# EasyEDA schematic SCH_AD741-discrete_2022-10-03.json

## Sheets
1 P1: TITLE: Sheet_1; REV: 1.0; Date: 2022-10-02; Sheet: 1/1; Drawn By: Denjhang; Company: Your Company
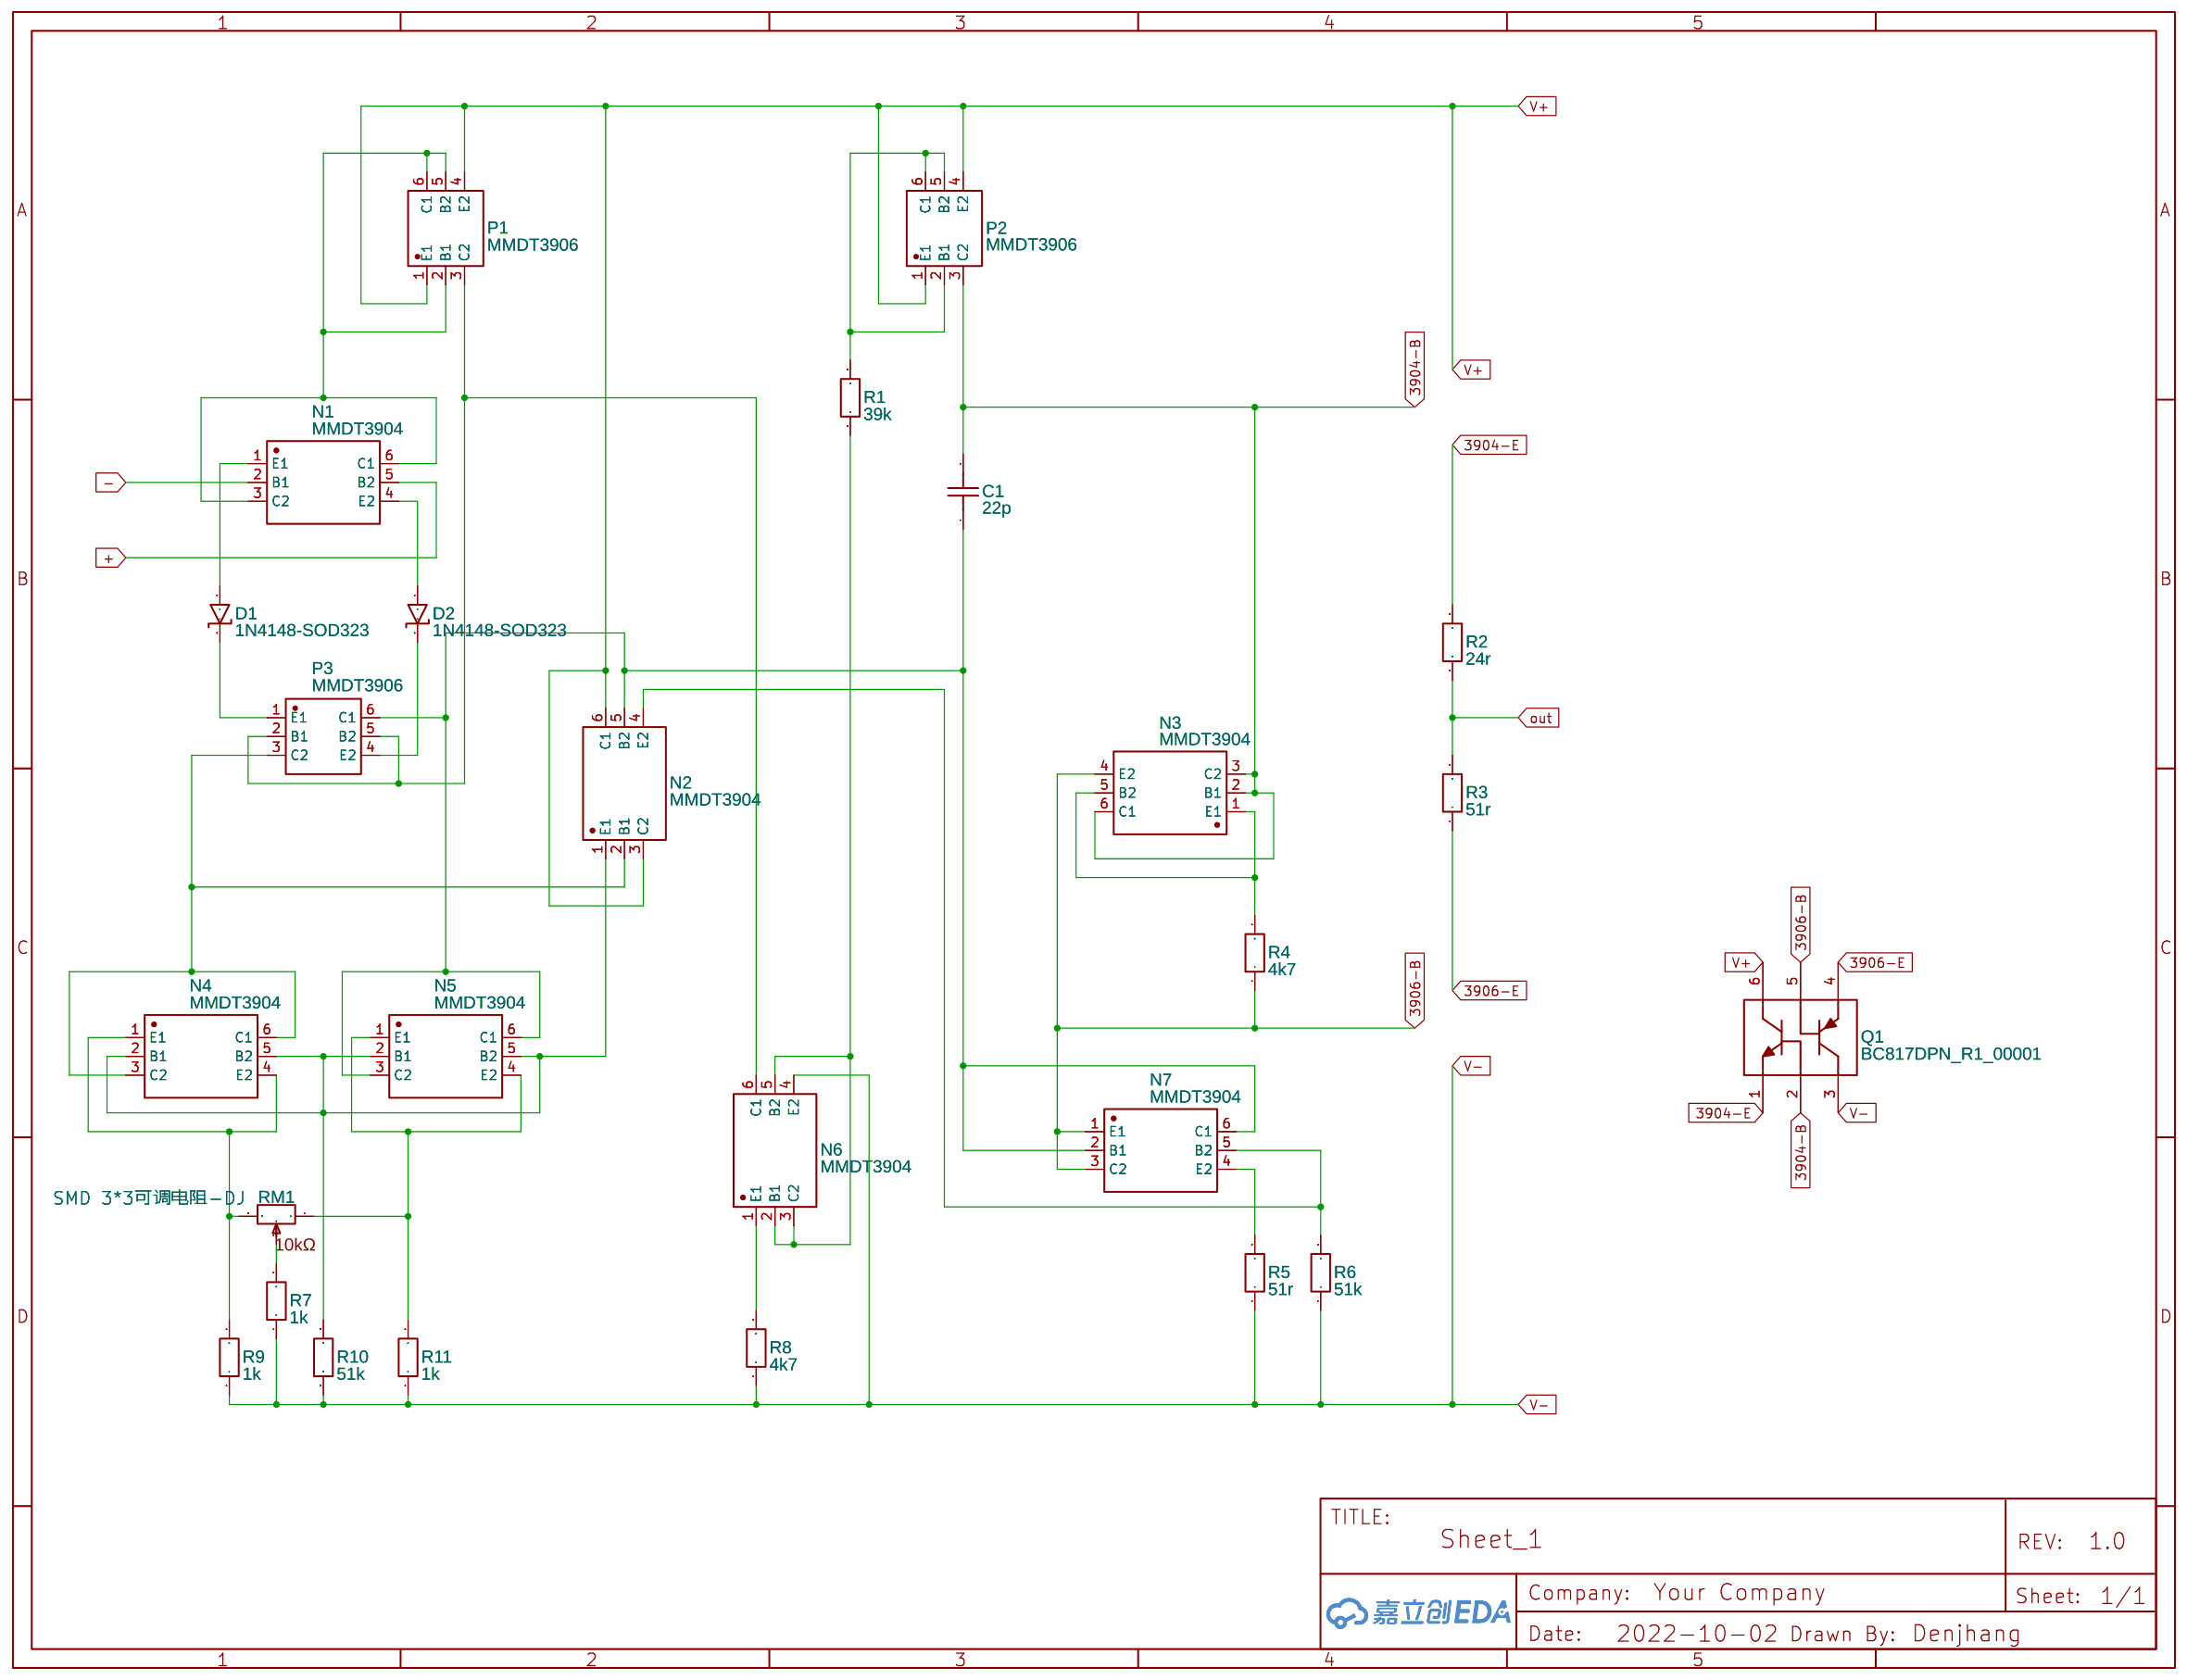
[diagram p0: P1]
2 CONN
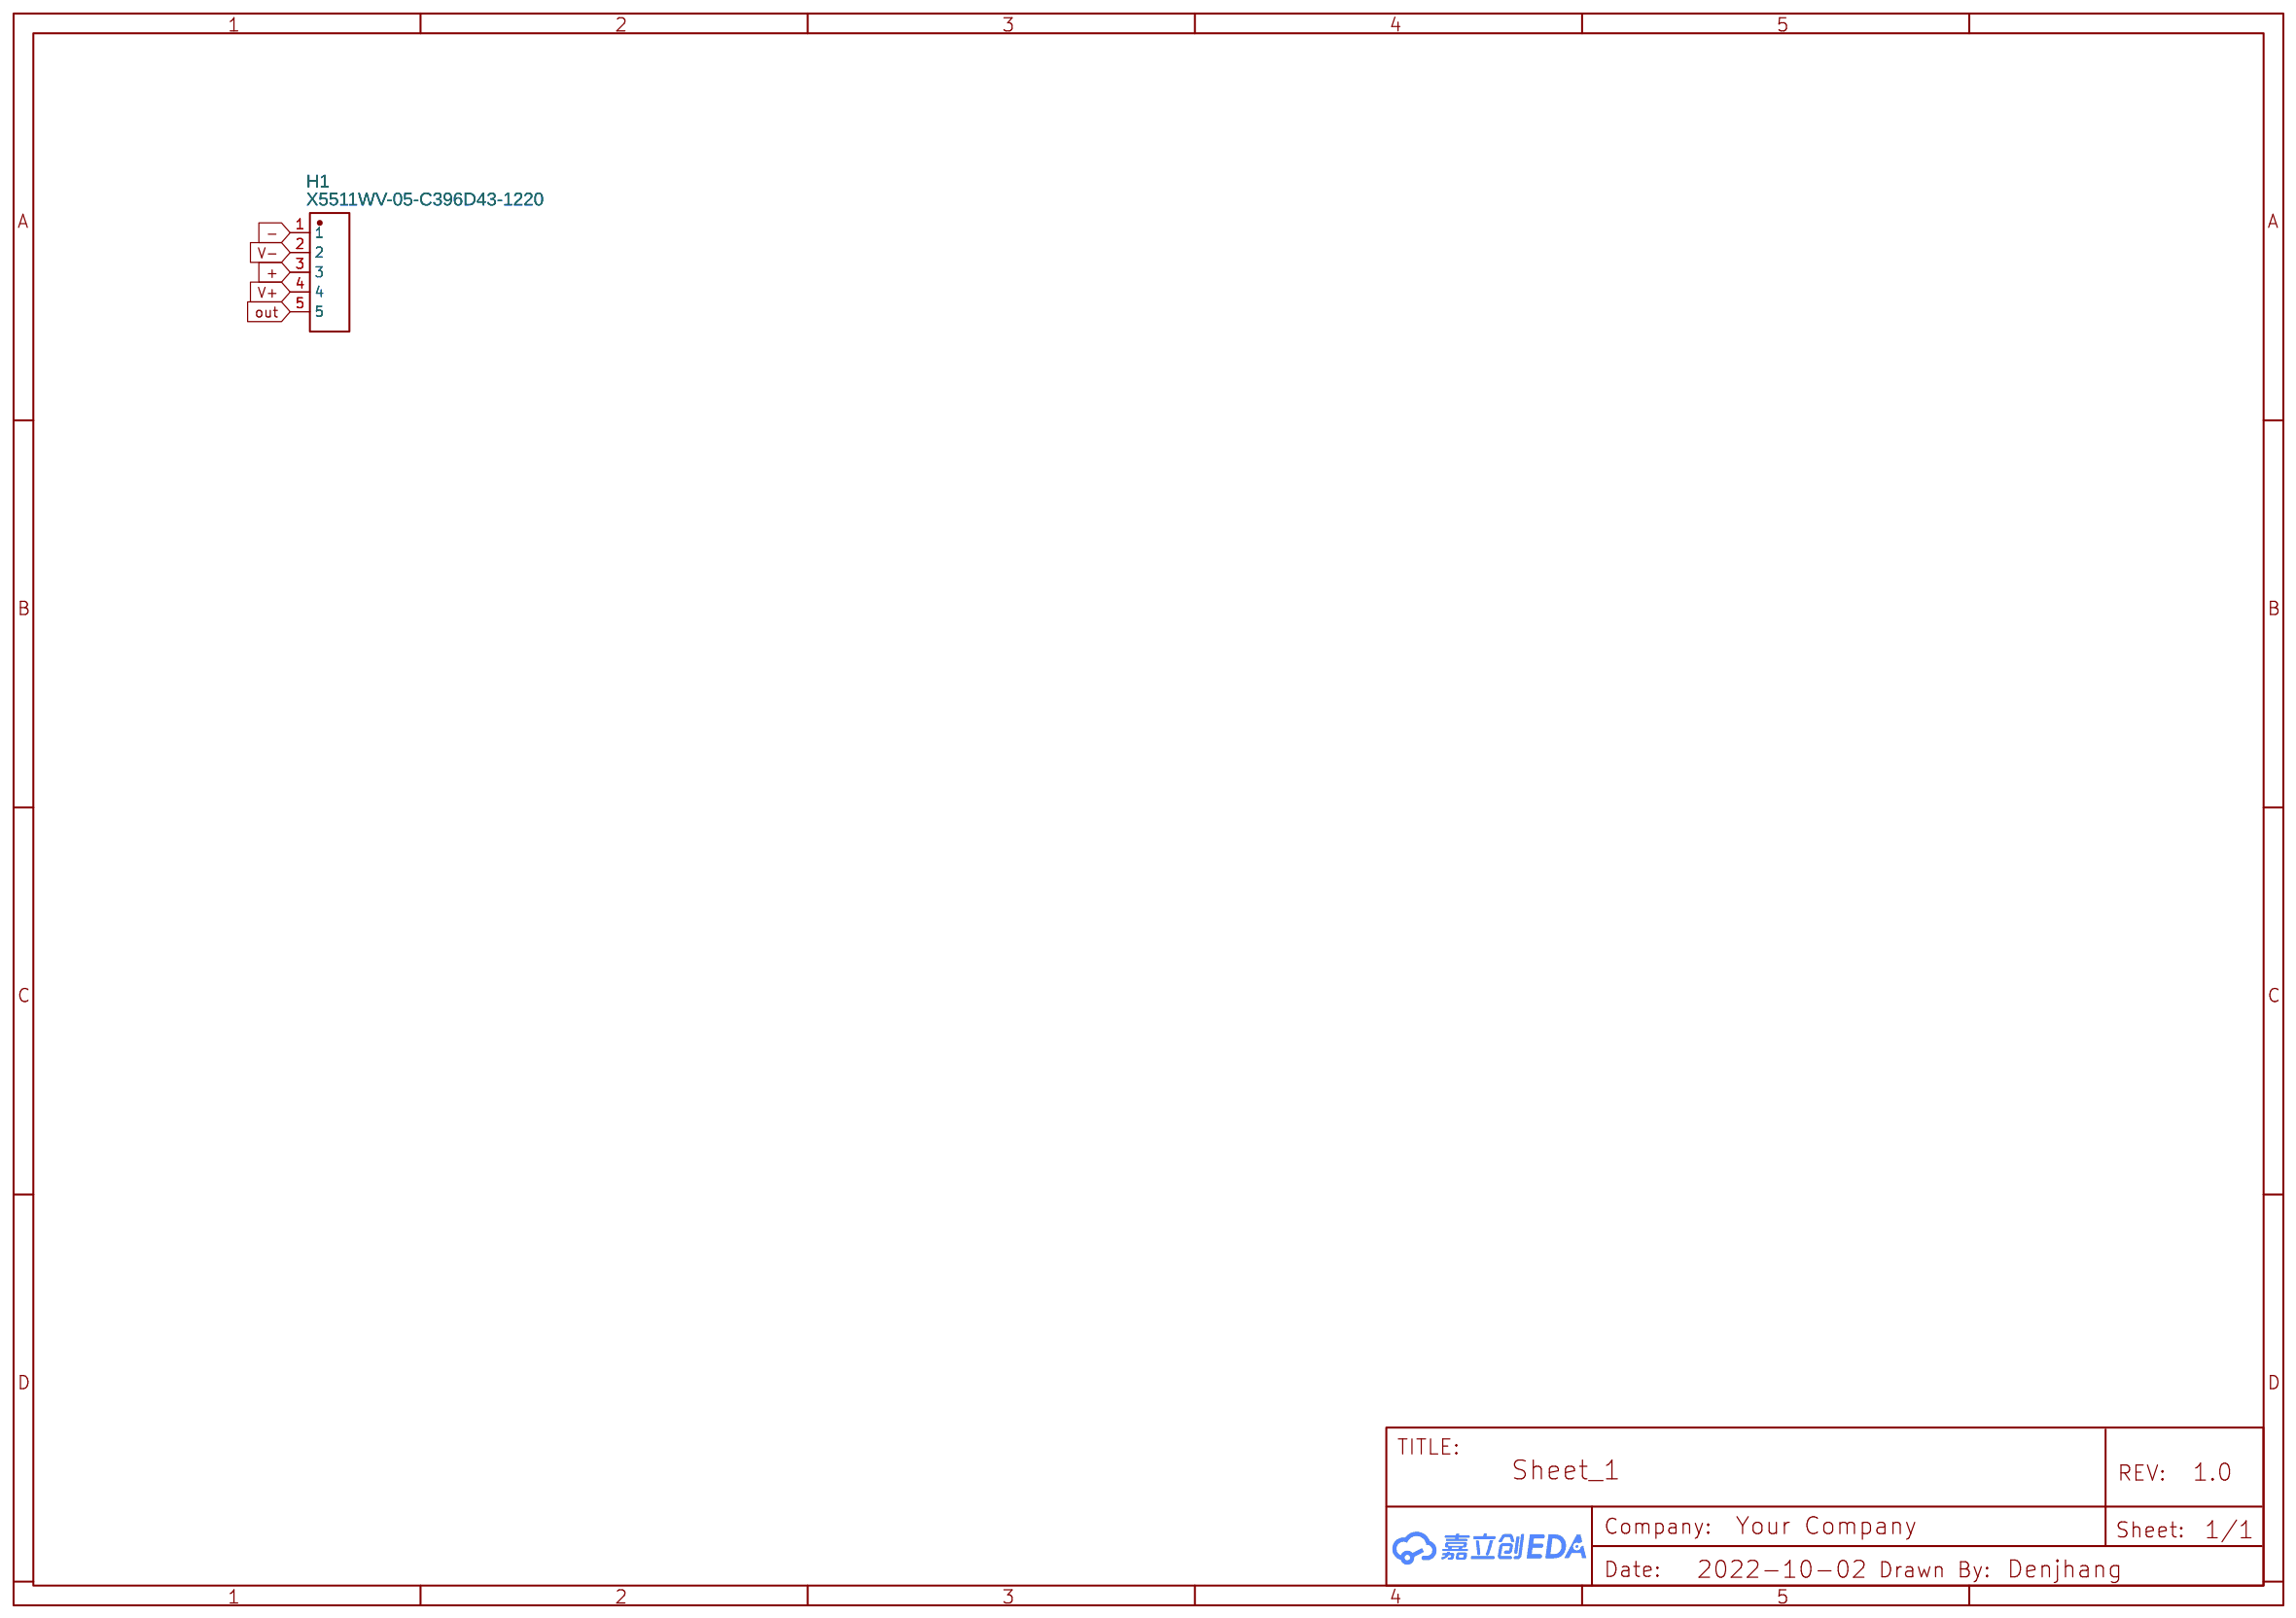
[diagram p1: CONN]

## Parts
sheet CONN
H1  X5511WV-05-C396D43-1220  [HDR-TH_5P-P2.54-V-M]
sheet P1
C1  22p  [C0603]
D1  1N4148-SOD323  [SOD-323_L1.7-W1.3-LS2.5-FD]
D2  1N4148-SOD323  [SOD-323_L1.7-W1.3-LS2.5-FD]
N1  MMDT3904  [SOT-363_L2.0-W1.3-P0.65-LS2.1-BR]
N2  MMDT3904  [SOT-363_L2.0-W1.3-P0.65-LS2.1-BR]
N3  MMDT3904  [SOT-363_L2.0-W1.3-P0.65-LS2.1-BR]
N4  MMDT3904  [SOT-363_L2.0-W1.3-P0.65-LS2.1-BR]
N5  MMDT3904  [SOT-363_L2.0-W1.3-P0.65-LS2.1-BR]
N6  MMDT3904  [SOT-363_L2.0-W1.3-P0.65-LS2.1-BR]
N7  MMDT3904  [SOT-363_L2.0-W1.3-P0.65-LS2.1-BR]
P1  MMDT3906  [SOT-363_L2.0-W1.3-P0.65-LS2.1-BL]
P2  MMDT3906  [SOT-363_L2.0-W1.3-P0.65-LS2.1-BL]
P3  MMDT3906  [SOT-363_L2.0-W1.3-P0.65-LS2.1-BL]
Q1  BC817DPN_R1_00001  [SOT-457_L2.9-W1.5-P0.95-LS2.8-BL]
R1  39k  [R0603]
R2  24r  [R0603]
R3  51r  [R0603]
R4  4k7  [R0603]
R5  51r  [R0603]
R6  51k  [R0603]
R7  1k  [R0603]
R8  4k7  [R0603]
R9  1k  [R0603]
R10  51k  [R0603]
R11  1k  [R0603]
RM1  SMD 3*3可调电阻-DJ  [3*3可调电阻]

## Library data of the parts
H1 = X5511WV-05-C396D43-1220: Supplier: LCSC; Supplier Part: C2883392; Manufacturer: XKB Connectivity(中国星坤); link: https://atta.szlcsc.com/upload/public/pdf/source/20211009/7D13F627EAEF227E7F3D2A55C463773D.pdf; Contributor: LCSC
C1 = C_0603_US: Contributor: LCEDA_Lib
D1 D2 = 1N4148-SOD323: Supplier: LCSC; Supplier Part: C9900014362; Manufacturer: null; JLCPCB Part Class: Extended Part; Contributor: Denjhang
N1-N7 = MMDT3904: Supplier: LCSC; Supplier Part: C21664; Manufacturer: Changjiang Electronics Tech (CJ); Contributor: LCSC; JLCPCB Part Class: Extended Part
P1-P3 = MMDT3906: Supplier: LCSC; Supplier Part: C20534; Manufacturer: Changjiang Electronics Tech (CJ); Contributor: LCSC; JLCPCB Part Class: Extended Part
Q1 = BC817DPN_R1_00001: Supplier: LCSC; Supplier Part: C696397; Manufacturer: PANJIT(强茂); Contributor: LCSC; JLCPCB Part Class: Extended Part
R1-R11 = R_0603_EU: Contributor: LCEDA_Lib
RM1 = SMD 3*3可调电阻-DJ: Contributor: Denjhang

## Nets
3904-B: C1.2 N3.2(B1) N3.3(C2) N3.6(C1) P2.3(C2) Q1.2(B1)
3904-E: Q1.1(E1) R2.2
3906-B: N3.4(E2) N7.1(E1) N7.3(C2) Q1.5(B2) R4.1
3906-E: Q1.4(E2) R3.1
+: H1.3 N1.5(B2)
-: H1.1 N1.2(B1)
out: H1.5 R2.1 R3.2
V+: H1.4 N2.3(C2) N2.6(C1) P1.1(E1) P1.4(E2) P2.1(E1) P2.4(E2) Q1.6(C1)
V-: H1.2 N6.4(E2) Q1.3(C2) R5.1 R6.1 R7.1 R8.1 R9.1 R10.1 R11.1
Net-(C1-1): C1.1 N2.5(B2) N5.3(C2) N5.6(C1) N7.2(B1) N7.6(C1) P3.6(C1)
Net-(D1-1): D1.1(A) N1.1(E1)
Net-(D1-2): D1.2(K) P3.1(E1)
Net-(D2-1): D2.1(A) N1.4(E2)
Net-(D2-2): D2.2(K) P3.4(E2)
Net-(N1-3): N1.3(C2) N1.6(C1) P1.2(B1) P1.5(B2) P1.6(C1)
Net-(N2-1): N2.1(E1) N4.2(B1) N4.5(B2) N5.2(B1) N5.5(B2) R10.2
Net-(N2-2): N2.2(B1) N4.3(C2) N4.6(C1) P3.3(C2)
Net-(N2-4): N2.4(E2) N7.5(B2) R6.2
Net-(N3-1): N3.1(E1) N3.5(B2) R4.2
Net-(N4-1): N4.1(E1) N4.4(E2) R9.2 RM1.3
Net-(N5-1): N5.1(E1) N5.4(E2) R11.2 RM1.1
Net-(N6-1): N6.1(E1) R8.2
Net-(N6-2): N6.2(B1) N6.3(C2) N6.5(B2) R1.1
Net-(N6-6): N6.6(C1) P1.3(C2) P3.2(B1) P3.5(B2)
Net-(N7-4): N7.4(E2) R5.2
Net-(P2-2): P2.2(B1) P2.5(B2) P2.6(C1) R1.2
Net-(R7-2): R7.2 RM1.2
